# EAGLE design yawspi-main (EAGLE 6.5.0)
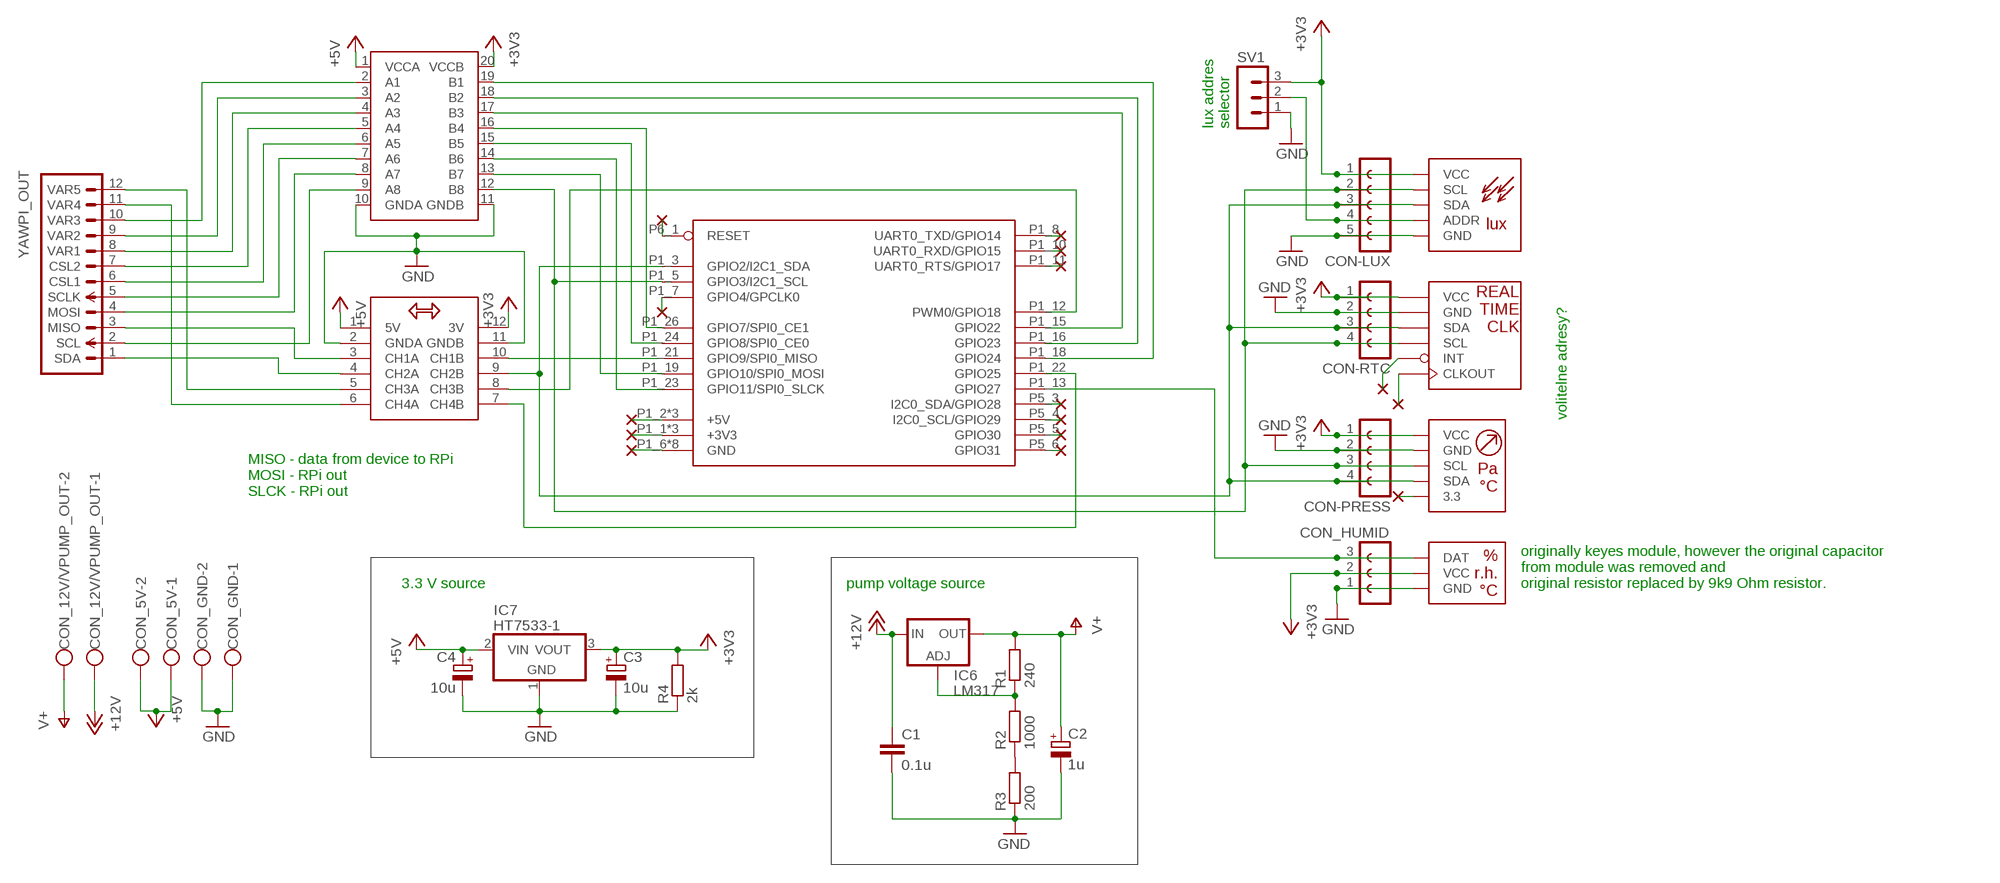
[diagram p0: schematic, sheet 1]

## Parts
C1  0.1u  C-EU025-025X050  [C025-025X050]
C2  1u  CPOL-EUE2,5-6E  [E2,5-6E]
C3  10u  CPOL-EUE2.5-5  [E2,5-5]
C4  10u  CPOL-EUE2.5-5  [E2,5-5]
CON-LUX  FE05-1  [FE05-1]
CON-PRESS  FE04-1  [FE04-1]
CON-RTC  FE04-1  [FE04-1]
CON_5V  W237-102  [W237-102]
CON_12V/VPUMP_OUT  W237-102  [W237-102]
CON_GND  W237-102  [W237-102]
CON_HUMID  FE03-1  [FE03-1]
IC6  LM317  LM317TS  [317TS]
IC7  HT7533-1  [TO92]
R1  240  R-EU_0204/2V  [0204V]
R2  1000  R-EU_0204/2V  [0204V]
R3  200  R-EU_0204/2V  [0204V]
R4  2k  R-EU_0204/2V  [0204V]
SV1  MA03-1  [MA03-1]
U$1  RPI-B-V2HOLES  [RPI-B-V2-HOLES]
U$2  BIDIR_CONVERSION_MODULE  [BIDIR_CONVERSION_MODULE]
U$3  LEVEL_CONVERSION_MODULE  [LEVEL_CONVERSION_MODULE]
U$4  HUMIDITY_MODULE  (no package)
U$5  LIGHT_MODULE  (no package)
U$6  NOT_CONNECTED  (no package)
U$7  RTC_MODULE  (no package)
U$8  PRESSURE_MODULE  (no package)
U$9  NOT_CONNECTED  (no package)
U$10  NOT_CONNECTED  (no package)
U$11  NOT_CONNECTED  (no package)
U$12  NOT_CONNECTED  (no package)
U$13  NOT_CONNECTED  (no package)
U$14  NOT_CONNECTED  (no package)
U$15  NOT_CONNECTED  (no package)
U$16  NOT_CONNECTED  (no package)
U$17  NOT_CONNECTED  (no package)
U$18  NOT_CONNECTED  (no package)
U$19  NOT_CONNECTED  (no package)
U$20  NOT_CONNECTED  (no package)
U$21  NOT_CONNECTED  (no package)
U$22  NOT_CONNECTED  (no package)
YAWPI_OUT  CON-YAWPI-OUT  [MA12-1]

## Nets
+3V3: C3.+ CON-LUX.1 CON-PRESS.1 CON-RTC.1 CON_HUMID.2 IC7.3(VOUT) R4.2 SV1.3 U$2.12(3V) U$3.20(VCCB) U$4.VCC U$5.VCC U$7.VCC U$8.VCC
+5V: C4.+ CON_5V.1 CON_5V.2 IC7.2(VIN) U$2.1(5V) U$3.1(VCCA)
+12V: C1.1 CON_12V/VPUMP_OUT.1 IC6.3(IN)
GND: C1.2 C2.- C3.- C4.- CON-LUX.5 CON-PRESS.2 CON-RTC.2 CON_GND.1 CON_GND.2 CON_HUMID.1 IC7.1(GND) R3.1 R4.1 SV1.1 U$2.2(GNDA) U$2.11(GNDB) U$3.10(GNDA) U$3.11(GNDB) U$4.GND U$5.GND U$7.GND U$8.GND
MOSI: U$1.P1_19(GPIO10/SPI0_MOSI) U$3.13(B7)
N$1: U$3.9(A8) YAWPI_OUT.2(SCL)
N$2: U$3.6(A5) YAWPI_OUT.6(CSL1)
N$3: U$2.4(CH2A) YAWPI_OUT.1(SDA)
N$4: U$1.P1_21(GPIO9/SPI0_MISO) U$2.10(CH1B)
N$5: U$3.7(A6) YAWPI_OUT.5(SCLK)
N$6: U$3.8(A7) YAWPI_OUT.4(MOSI)
N$7: U$2.3(CH1A) YAWPI_OUT.3(MISO)
N$8: U$3.5(A4) YAWPI_OUT.7(CSL2)
N$9: U$1.P1_12(PWM0/GPIO18) U$2.8(CH3B)
N$10: U$1.P1_22(GPIO25) U$2.7(CH4B)
N$11: U$3.4(A3) YAWPI_OUT.8(VAR1)
N$12: U$3.3(A2) YAWPI_OUT.9(VAR2)
N$13: U$3.2(A1) YAWPI_OUT.10(VAR3)
N$14: U$2.6(CH4A) YAWPI_OUT.11(VAR4)
N$15: U$2.5(CH3A) YAWPI_OUT.12(VAR5)
N$16: U$1.P1_24(GPIO8/SPI0_CE0) U$3.15(B5)
N$17: U$1.P1_26(GPIO7/SPI0_CE1) U$3.16(B4)
N$18: U$1.P1_15(GPIO22) U$3.17(B3)
N$19: U$1.P1_16(GPIO23) U$3.18(B2)
N$20: U$1.P1_18(GPIO24) U$3.19(B1)
N$21: CON_HUMID.3 U$1.P1_13(GPIO27) U$4.DAT
N$22: U$1.P1_6(GND) U$1.P1_9(GND) U$1.P1_14(GND) U$1.P1_20(GND) U$1.P1_25(GND) U$1.P5_7(GND) U$1.P5_8(GND) U$1.P6_2(GND) U$22.NC$1
N$23: CON-LUX.4 SV1.2 U$5.ADDR
N$27: U$1.P1_2(+5V) U$1.P1_4(+5V) U$1.P5_1(+5V) U$6.NC$1
N$28: U$1.P1_1(+3V3) U$1.P1_17(+3V3) U$1.P5_2(+3V3) U$9.NC$1
N$29: U$8.3.3 U$10.NC$1
N$30: U$7.CLKOUT U$11.NC$1
N$31: U$7.INT U$12.NC$1
N$32: U$1.P1_8(UART0_TXD/GPIO14) U$13.NC$1
N$33: U$1.P1_10(UART0_RXD/GPIO15) U$14.NC$1
N$34: U$1.P1_11(UART0_RTS/GPIO17) U$15.NC$1
N$35: U$1.P1_7(GPIO4/GPCLK0) U$20.NC$1
N$36: U$1.P5_6(GPIO31) U$19.NC$1
N$37: U$1.P5_5(GPIO30) U$18.NC$1
N$38: U$1.P5_4(I2C0_SCL/GPIO29) U$17.NC$1
N$39: U$1.P5_3(I2C0_SDA/GPIO28) U$16.NC$1
N$40: U$1.P6_1(RESET) U$21.NC$1
N$51: IC6.1(ADJ) R1.1 R2.2
N$60: R2.1 R3.2
SCL: CON-LUX.2 CON-PRESS.3 CON-RTC.4 U$1.P1_5(GPIO3/I2C1_SCL) U$3.12(B8) U$5.SCL U$7.SCL U$8.SCL
SDA: CON-LUX.3 CON-PRESS.4 CON-RTC.3 U$1.P1_3(GPIO2/I2C1_SDA) U$2.9(CH2B) U$5.SDA U$7.SDA U$8.SDA
SLCK: U$1.P1_23(GPIO11/SPI0_SLCK) U$3.14(B6)
V+: C2.+ CON_12V/VPUMP_OUT.2 IC6.2(OUT) R1.2

## Notes on the sheet
- lux addres
  selector
- volitelne adresy?
- MISO - data from device to RPi
  MOSI - RPi out
  SLCK - RPi out
- 3.3 V source | pump voltage source
- originally keyes module, however the original capacitor
  from module was removed and
  original resistor replaced by 9k9 Ohm resistor.

## Library data of the parts
C1 = rcl:C-EU: CAPACITOR, European symbol
C2 = rcl:CPOL-EU: POLARIZED CAPACITOR, European symbol
C3 C4 = resistor:CPOL-EU: POLARIZED CAPACITOR, European symbol
CON-LUX = con-lsta:FE05-1: FEMALE HEADER; OC_FARNELL: unknown; OC_NEWARK: unknown
CON-PRESS CON-RTC = various:FE04-1: FEMALE HEADER; OC_FARNELL: unknown; OC_NEWARK: unknown
CON_5V CON_12V/VPUMP_OUT CON_GND = con-wago-500:W237-102: WAGO SCREW CLAMP; MPN: 237-102; OC_FARNELL: unknown; OC_NEWARK: 70K9898
CON_HUMID = various:FE03-1
IC6 = v-reg:LM317TS: VOLTAGE REGULATOR
IC7 = various:HT7533-1: Positive VOLTAGE REGULATOR The HT75XX-1 series is a set of three-terminal high cur- rent low voltage regulator implemented in CMOS tech- nology. They can deliver 100mA output current and allow an input voltage as high as 24V. They are avail- able with several fixed output voltages ranging from 3.0V to 5.0V. CMOS technology ensures low voltage drop and low quiescent current.
R1-R4 = resistor:R-EU_: RESISTOR, European symbol
SV1 = con-lstb:MA03-1: PIN HEADER; OC_FARNELL: unknown; OC_NEWARK: unknown
U$1 = raspberrypi:RPI-B-V2: Second revision of the Model 2 board including the P5 and P6 headers. Mounting holes have been added. Choose the "SHIELD" variant for a predefined Dimension layer and drilling holes. Theres also a "SHIELD" variant for the Model A without a RJ45 connector.
U$2 = various:BIDIR_CONVERSION_MODULE: JY-MCU 5V 3V IIC UART SPI Level 4-Way Converter Module Adapter
U$3 = various:LEVEL_CONVERSION_MODULE: 74LVC8T245 8-CH TTL COMS Level Conversion Module
U$4 = various:HUMIDITY_MODULE: Keyes DHT11 FR4 Temperature / Humidity Sensor Module
U$5 = various:LIGHT_MODULE: GY-30 BH1750FVI intensity Digital Light Sensor Module
U$6 U$9-U$22 = various:NOT_CONNECTED
U$7 = various:RTC_MODULE: PCF8563 RTC Board For Raspberry Pi Real Time Clock
U$8 = various:PRESSURE_MODULE: BMP180 BOSCH Temperature / Air Pressure Module
YAWPI_OUT = various:CON-YAWPI-OUT: Special connector for YAWPI project, board output

## Board
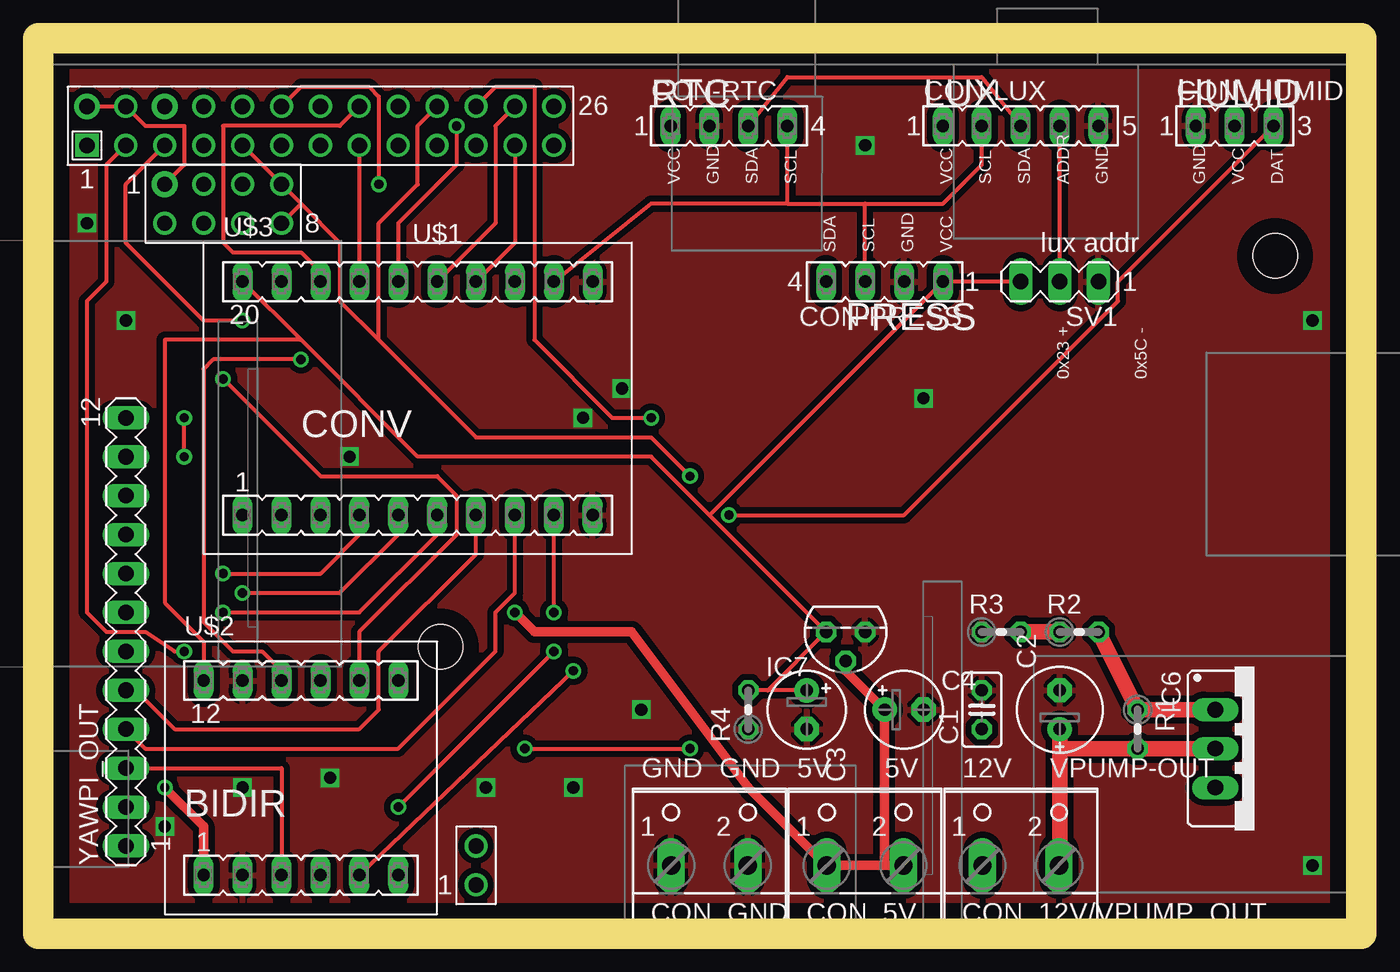
[diagram p1: board, top side]
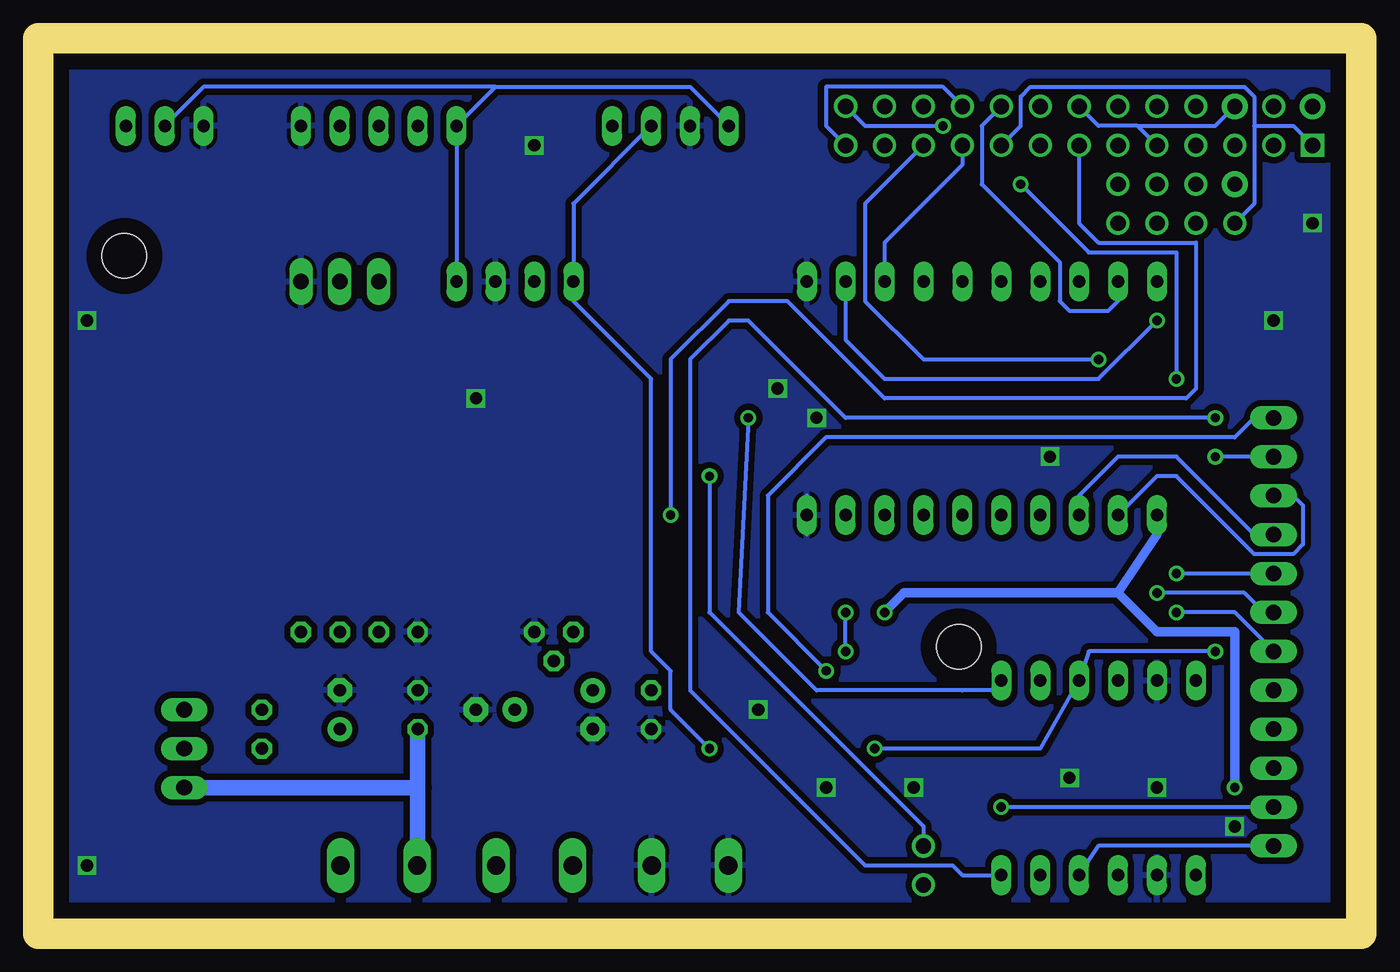
[diagram p2: board, bottom side, seen from below]

Size 86.36 x 58.42 mm. Coordinates in mm from the lower left corner, seen from the top.
Outline: 0,58.42 0,0 86.36,0 86.36,58.42 0,58.42
Copper layers (1*16): Top 0.035mm / dielectric 1.5mm / Bottom 0.035mm
Design rules "default": minimum track width 10mil, minimum drill 24mil, track to track 8mil, track to pad 8mil, pad to pad 8mil, via to via 8mil, smd to smd 8mil, copper to edge 40mil, drill to drill 8mil, minimum pad ring 10mil, minimum via ring 8mil, stop-mask expansion 4mil, vias tented up to drill 0mil, thermal gap 10mil

### Footprints (pad centres in the part's own frame; a part is rotated, then mirrored left to right if it is on the bottom)
C025-025X050 = drill 0.813 octagon: 1 -1.27,0; 2 1.27,0
E2,5-6E = drill 0.813 pad 1.575: + -1.27,0 | drill 0.813 pad 1.575 octagon: - 1.27,0
E2,5-5 = drill 0.813 pad 1.6: + -1.27,0 | drill 0.813 pad 1.6 octagon: - 1.27,0
FE05-1 = drill 0.813 long: 1 -5.08,0; 2 -2.54,0; 3 0,0; 4 2.54,0; 5 5.08,0
FE04-1 = drill 0.813 long: 1 -5.08,0; 2 -2.54,0; 3 0,0; 4 2.54,0
W237-102 = drill 1.194 long: 1 -2.5,-1.27; 2 2.5,-1.27
FE03-1 = drill 0.813 long: 1 -3.81,0; 2 -1.27,0; 3 1.27,0
317TS = drill 1.016 long: 1 -2.54,-2.54; 2 0,-2.54; 3 2.54,-2.54
TO92 = drill 0.813 octagon: 1 -1.27,0; 2 0,1.905; 3 1.27,0
0204V = drill 0.813 octagon: 1 -1.27,0; 2 1.27,0
MA03-1 = drill 1.016 long: 1 -2.54,0; 2 0,0; 3 2.54,0
RPI-B-V2-HOLES = drill 1 square: P1_1 -41.91,21.59 | drill 1 pad 1.676: P1_2 -41.91,24.13; P1_6 -36.83,24.13; P5_1 -36.83,19.05 | drill 1: P1_3 -39.37,21.59; P1_4 -39.37,24.13; P1_5 -36.83,21.59; P1_7 -34.29,21.59; P1_8 -34.29,24.13; P1_9 -31.75,21.59; P1_10 -31.75,24.13; P1_11 -29.21,21.59; P1_12 -29.21,24.13; P1_13 -26.67,21.59; P1_14 -26.67,24.13; P1_15 -24.13,21.59; P1_16 -24.13,24.13; P1_17 -21.59,21.59; P1_18 -21.59,24.13; P1_19 -19.05,21.59; P1_20 -19.05,24.13; P1_21 -16.51,21.59; P1_22 -16.51,24.13; P1_23 -13.97,21.59; P1_24 -13.97,24.13; P1_25 -11.43,21.59; P1_26 -11.43,24.13; P5_2 -36.83,16.51; P5_3 -34.29,19.05; P5_4 -34.29,16.51; P5_5 -31.75,19.05; P5_6 -31.75,16.51; P5_7 -29.21,19.05; P5_8 -29.21,16.51; P6_1 -16.51,-26.67; P6_2 -16.51,-24.13 | hole 2.9: -18.81,-11.13; 35.66,14.38
BIDIR_CONVERSION_MODULE = drill 0.813 long: 1 -6.35,-5.08; 2 -3.81,-5.08; 3 -1.27,-5.08; 4 1.27,-5.08; 5 3.81,-5.08; 6 6.35,-5.08; 7 6.35,7.62; 8 3.81,7.62; 9 1.27,7.62; 10 -1.27,7.62; 11 -3.81,7.62; 12 -6.35,7.62
LEVEL_CONVERSION_MODULE = drill 0.813 long: 1 -11.43,-6.35; 2 -8.89,-6.35; 3 -6.35,-6.35; 4 -3.81,-6.35; 5 -1.27,-6.35; 6 1.27,-6.35; 7 3.81,-6.35; 8 6.35,-6.35; 9 8.89,-6.35; 10 11.43,-6.35; 11 11.43,8.89; 12 8.89,8.89; 13 6.35,8.89; 14 3.81,8.89; 15 1.27,8.89; 16 -1.27,8.89; 17 -3.81,8.89; 18 -6.35,8.89; 19 -8.89,8.89; 20 -11.43,8.89
MA12-1 = drill 1.016 long: 1 -13.97,0; 2 -11.43,0; 3 -8.89,0; 4 -6.35,0; 5 -3.81,0; 6 -1.27,0; 7 1.27,0; 8 3.81,0; 9 6.35,0; 10 8.89,0; 11 11.43,0; 12 13.97,0

### Placement (x,y rotation side)
C1  61.59,14.61 90 top
C2  66.68,14.61 90 top
C3  50.16,14.61 270 top
C4  56.52,14.61 0 top
CON-LUX  64.14,52.7 0 top
CON-PRESS  53.98,42.54 180 top
CON-RTC  46.35,52.7 0 top
CON_5V  53.98,5.71 0 top
CON_12V/VPUMP_OUT  64.14,5.71 0 top
CON_GND  43.81,5.71 0 top
CON_HUMID  79.38,52.7 0 top
IC6  79.38,12.06 270 top
IC7  52.7,19.69 180 top
R1  71.76,13.33 270 top
R2  67.95,19.69 0 top
R3  62.86,19.69 0 top
R4  46.35,14.61 90 top
SV1  66.68,42.54 180 top
U$1  45.09,29.85 0 top
U$2  17.15,8.89 0 top
U$3  24.77,33.66 0 top
YAWPI_OUT  5.71,19.69 90 top

### Tracks (layer width: path | path; a pad name or v marks a point on that pad's centre or on a via)
+3V3
  Top 0.254: 17.15,38.73 8.26,38.73 8.26,21.59 10.79,19.05 U$2.12 | C3.+ 47.62,15.88 | 47.62,15.88 R4.2 | 47.62,15.88 IC7.3 43.81,27.31 | 17.15,38.73 24.77,31.12 40,31.12 43.81,27.31 | 17.15,38.73 U$3.20 | SV1.3 CON-PRESS.1 43.81,27.31
  Bottom 0.254: CON-RTC.1 43.81,55.24 56.52,55.24 | 56.52,55.24 CON-LUX.1 CON-PRESS.1 | CON_HUMID.2 75.57,55.24 56.52,55.24
+5V  (via drill 0.61)
  Top 0.254: 56.52,4.45 CON_5V.2 | 51.43,4.45 CON_5V.1
  Top 0.61: IC7.2 52.7,17.15 C4.+ 55.24,4.45 | CON_5V.2 55.24,4.45 | 55.24,4.45 CON_5V.1 | v31.12,20.96 32.38,19.69 38.73,19.69 46.35,9.53 51.43,4.45 | U$2.1 10.79,6.98 v8.26,9.53
  Bottom 0.61: 15.88,22.23 13.33,26.04 U$3.1 | 15.88,22.23 29.85,22.23 v31.12,20.96 | v8.26,9.53 8.26,19.69 13.33,19.69 15.88,22.23
+12V
  Bottom 0.254: 61.59,4.45 CON_12V/VPUMP_OUT.1
  Bottom 1.016: 61.59,4.45 61.59,9.53 | 61.59,9.53 IC6.3 | 61.59,9.53 C1.1
GND  (via drill 0.8)
  Bottom 0.254: U$3.10 | 36.2,26.04 U$3.10 | 36.2,28.58 U$3.10
  other vias: 83.19,40 83.19,4.45 3.17,46.35 34.92,9.53 39.37,14.61 13.33,9.53 5.71,40 57.78,34.92 53.98,51.43 20.32,31.12 38.1,35.56 35.56,33.66 19.05,10.16 29.21,9.53 8.26,6.98
  pour Top (isolate 0.406): 0.64,42.54 0.64,0.64 87,0.64 87,57.78 0.64,57.78 0.64,45.09 1.91,45.09 1.91,42.54
  pour Bottom (isolate 0.406): 0.64,37.46 0.64,0.64 87,0.64 87,57.78 0.64,57.78 0.64,40 1.91,40 1.91,37.46
MOSI
  Bottom 0.254: U$3.13 31.12,45.09 26.04,50.16 U$1.P1_19
N$1  (via drill 0.61)
  Top 0.254: v33.66,20.96 U$3.9 | v23.5,8.26 v33.66,18.42
  Bottom 0.254: v33.66,18.42 v33.66,20.96 | YAWPI_OUT.2 v23.5,8.26
N$2  (via drill 0.61)
  Top 0.254: U$3.6 26.04,26.04 20.96,20.96 v12.06,20.96
  Bottom 0.254: v12.06,20.96 8.26,20.96 YAWPI_OUT.6
N$3
  Bottom 0.254: U$2.4 17.15,5.71 YAWPI_OUT.1
N$4  (via drill 0.61)
  Top 0.254: U$2.10 15.88,17.15 14.61,18.42 12.7,18.42 10.79,20.32 10.79,36.83 11.43,37.46 v17.15,37.46
  Bottom 0.254: v17.15,37.46 28.58,37.46 32.38,41.27 32.38,47.62 U$1.P1_21
N$5
  Top 0.254: U$3.7 28.58,24.77 22.23,18.42 22.23,14.61 20.96,13.33 8.89,13.33 6.35,15.88 YAWPI_OUT.5
N$6
  Top 0.254: U$3.8 31.12,22.23 29.85,20.96 29.85,18.42 23.5,12.06 6.98,12.06 YAWPI_OUT.4
N$7
  Top 0.254: U$2.3 15.88,10.79 YAWPI_OUT.3
N$8  (via drill 0.61)
  Top 0.254: U$3.5 23.5,26.04 19.69,22.23 v13.33,22.23
  Bottom 0.254: v13.33,22.23 7.62,22.23 6.35,20.96 YAWPI_OUT.7
N$9  (via drill 0.61)
  Top 0.254: v12.06,36.2 18.42,29.85 26.04,29.85 27.31,28.58 27.31,26.04 20.96,19.69 U$2.8 | v22.23,48.89 22.23,54.61 21.59,55.24 17.15,55.24 U$1.P1_12
  Bottom 0.254: v12.06,36.2 12.06,44.45 17.78,44.45 v22.23,48.89
N$10  (via drill 0.61)
  Top 0.254: v40,33.66 37.46,33.66 32.38,38.73 32.38,55.24 29.85,55.24 U$1.P1_22
  Bottom 0.254: v40,33.66 40.64,20.96 35.56,15.88 26.04,15.88 24.13,15.88 U$2.7
N$11  (via drill 0.61)
  Top 0.254: U$3.4 20.96,26.04 18.42,23.5 v12.06,23.5
  Bottom 0.254: YAWPI_OUT.8 v12.06,23.5
N$12
  Bottom 0.254: U$3.3 18.42,28.58 15.88,31.12 12.06,31.12 6.98,26.04 YAWPI_OUT.9
N$13
  Bottom 0.254: U$3.2 13.33,29.85 12.06,29.85 6.98,24.77 4.45,24.77 3.81,25.4 3.81,27.94 4.45,28.58 YAWPI_OUT.10
N$14  (via drill 0.61)
  Top 0.254: v9.53,31.12 v9.53,33.66
  Bottom 0.254: U$2.6 26.04,3.81 26.67,4.45 32.38,4.45 43.81,15.88 43.81,37.46 41.27,40 40,40 33.66,33.66 v9.53,33.66 | YAWPI_OUT.11 v9.53,31.12
N$15  (via drill 0.61)
  Top 0.254: v34.92,17.15 U$2.5
  Bottom 0.254: YAWPI_OUT.12 6.98,33.66 8.26,32.38 34.92,32.38 38.73,28.58 38.73,20.96 v34.92,17.15
N$16
  Top 0.254: U$3.15 29.85,46.35 29.85,52.7 U$1.P1_24
N$17  (via drill 0.61)
  Top 0.254: U$3.16 23.5,46.35 27.31,50.16 v27.31,52.7
  Bottom 0.254: v27.31,52.7 32.38,52.7 U$1.P1_26
N$18
  Top 0.254: U$1.P1_15 U$3.17
N$19
  Top 0.254: U$3.18 18.42,43.18 17.15,44.45 12.7,44.45 12.06,45.09 12.06,52.7 19.69,52.7 U$1.P1_16
N$20
  Bottom 0.254: U$3.19 15.88,41.27 16.51,40.64 19.05,40.64 19.69,41.27 19.69,43.81 24.77,48.89 24.77,52.7 U$1.P1_18
N$21  (via drill 0.61)
  Top 0.254: CON_HUMID.3 70.48,42.54 70.48,41.27 56.52,27.31 v45.09,27.31
  Bottom 0.254: v45.09,27.31 45.09,37.46 41.27,41.27 37.46,41.27 31.12,34.92 11.43,34.92 10.79,35.56 10.79,45.09 17.15,45.09 18.42,46.35 U$1.P1_13
N$22  (via drill 0.61)
  Top 0.254: v42.54,29.85 40,32.38 28.58,32.38 22.23,38.73 | 22.23,38.73 19.69,41.27 19.69,45.09 17.15,47.62 | 17.15,47.62 U$1.P5_7 U$1.P1_9 | 17.15,47.62 U$1.P5_8 | U$1.P1_20 24.77,52.7 24.77,48.89 22.23,46.35 22.23,38.73
  Bottom 0.254: U$1.P6_2 28.58,6.98 42.54,20.96 v42.54,29.85 | U$1.P1_14 17.15,52.7 14.61,52.7 | U$1.P1_9 14.61,52.7 | U$1.P1_25 34.92,52.7 34.92,55.24 27.31,55.24 U$1.P1_20 | U$1.P1_6 9.53,52.7 14.61,52.7
N$23
  Top 0.254: SV1.2 CON-LUX.4
N$27
  Top 0.254: U$1.P1_2 U$1.P1_4 6.98,52.7 9.53,52.7 9.53,50.16 U$1.P5_1
N$28
  Bottom 0.254: U$1.P1_1 4.45,52.7 6.98,52.7 | 6.98,52.7 6.98,54.61 7.62,55.24 21.59,55.24 22.23,54.61 22.23,52.7 U$1.P1_17 | U$1.P5_2 6.98,47.62 6.98,52.7
N$51
  Top 1.016: IC6.1 R1.1 R2.2
N$60
  Top 1.016: R2.1 R3.2
SCL  (via drill 0.61)
  Top 0.254: U$3.12 40,47.62 48.89,47.62 | U$1.P1_5 5.71,48.89 5.71,45.09 10.79,40 v13.33,40 | 48.89,47.62 CON-RTC.4 | 48.89,47.62 53.98,47.62 | 53.98,47.62 59.05,47.62 61.59,50.16 CON-LUX.2 | CON-PRESS.3 53.98,47.62
  Bottom 0.254: v13.33,40 17.15,36.2 31.12,36.2 33.66,38.73 U$3.12
SDA  (via drill 0.61)
  Top 0.254: CON-LUX.3 61.59,55.88 48.89,55.88 CON-RTC.3 | v9.53,18.42 8.89,18.42 6.98,19.69 4.45,19.69 3.17,20.96 3.17,41.27 4.45,42.54 4.45,50.16 U$1.P1_3 | v31.75,12.06 v42.54,12.06
  Bottom 0.254: CON-RTC.3 51.43,47.62 CON-PRESS.4 51.43,41.27 46.35,36.2 46.35,18.42 45.09,17.15 45.09,14.61 v42.54,12.06 | v9.53,18.42 17.78,18.42 U$2.9 20.96,12.06 v31.75,12.06
SLCK
  Top 0.254: U$3.14 31.12,45.09 U$1.P1_23
V+
  Top 0.254: 66.68,4.45 CON_12V/VPUMP_OUT.2
  Top 1.016: 66.68,4.45 66.68,12.06 | 66.68,12.06 C2.+ | 66.68,12.06 R1.2 IC6.2

### Text on the board
tPlace: RTC | LUX | HUMID | VCC | GND | SDA | SCL | VCC | SCL | SDA | ADDR | GND | GND | VCC | DAT | SDA | SCL | GND | VCC | lux addr | PRESS | 0x23 + | 0x5C - | CONV | GND | GND | 5V | 5V | 12V | VPUMP-OUT | BIDIR